# EAGLE design driver (EAGLE 7.5.0)
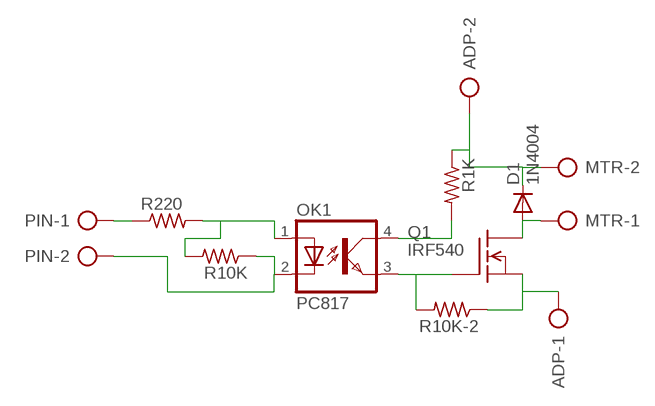
[diagram p0: schematic, sheet 1]

## Parts
ADP  AK300/2  [AK300/2]
D1  1N4004  [DO41-10]
MTR  AK300/2  [AK300/2]
OK1  PC817  [DIL04]
PIN  AK300/2  [AK300/2]
Q1  IRF540  [TO220]
R1K  R-US_0204/7  [0204/7]
R10K  R-US_0204/7  [0204/7]
R10K-2  R-US_0204/7  [0204/7]
R220  R-US_0204/7  [0204/7]

## Nets
N$1: OK1.1(A) R10K.2 R220.2
N$2: ADP.1 Q1.3(S) R10K-2.1
N$3: D1.A MTR.1 Q1.2(D)
N$4: OK1.3(EMIT) Q1.1(G) R10K-2.2
N$5: OK1.4(COL) R1K.2
N$7: PIN.1 R220.1
N$8: ADP.2 D1.C MTR.2 R1K.1
N$10: OK1.2(C) PIN.2 R10K.1

## Library data of the parts
ADP MTR PIN = con-ptr500:AK300/2: CONNECTOR; OC_FARNELL: unknown; OC_NEWARK: unknown
D1 = adafruit:1N4004: DIODE General purpose 1N400x type rectifier (With bigger pads) http://www.ladyada.net/library/pcb/eaglelibrary.html
OK1 = optocoupler:PC817: SHARP OPTO COUPLER; MPN: PC817X4J000F; OC_FARNELL: 9707727; OC_NEWARK: 97K7059
Q1 = transistor-fet:IRF540: N-Channel Enhancement MOSFET (HEXFET); 100V; 28A; 0,077Ohm
R1K R10K R10K-2 R220 = resistor:R-US_: RESISTOR, American symbol

## Board
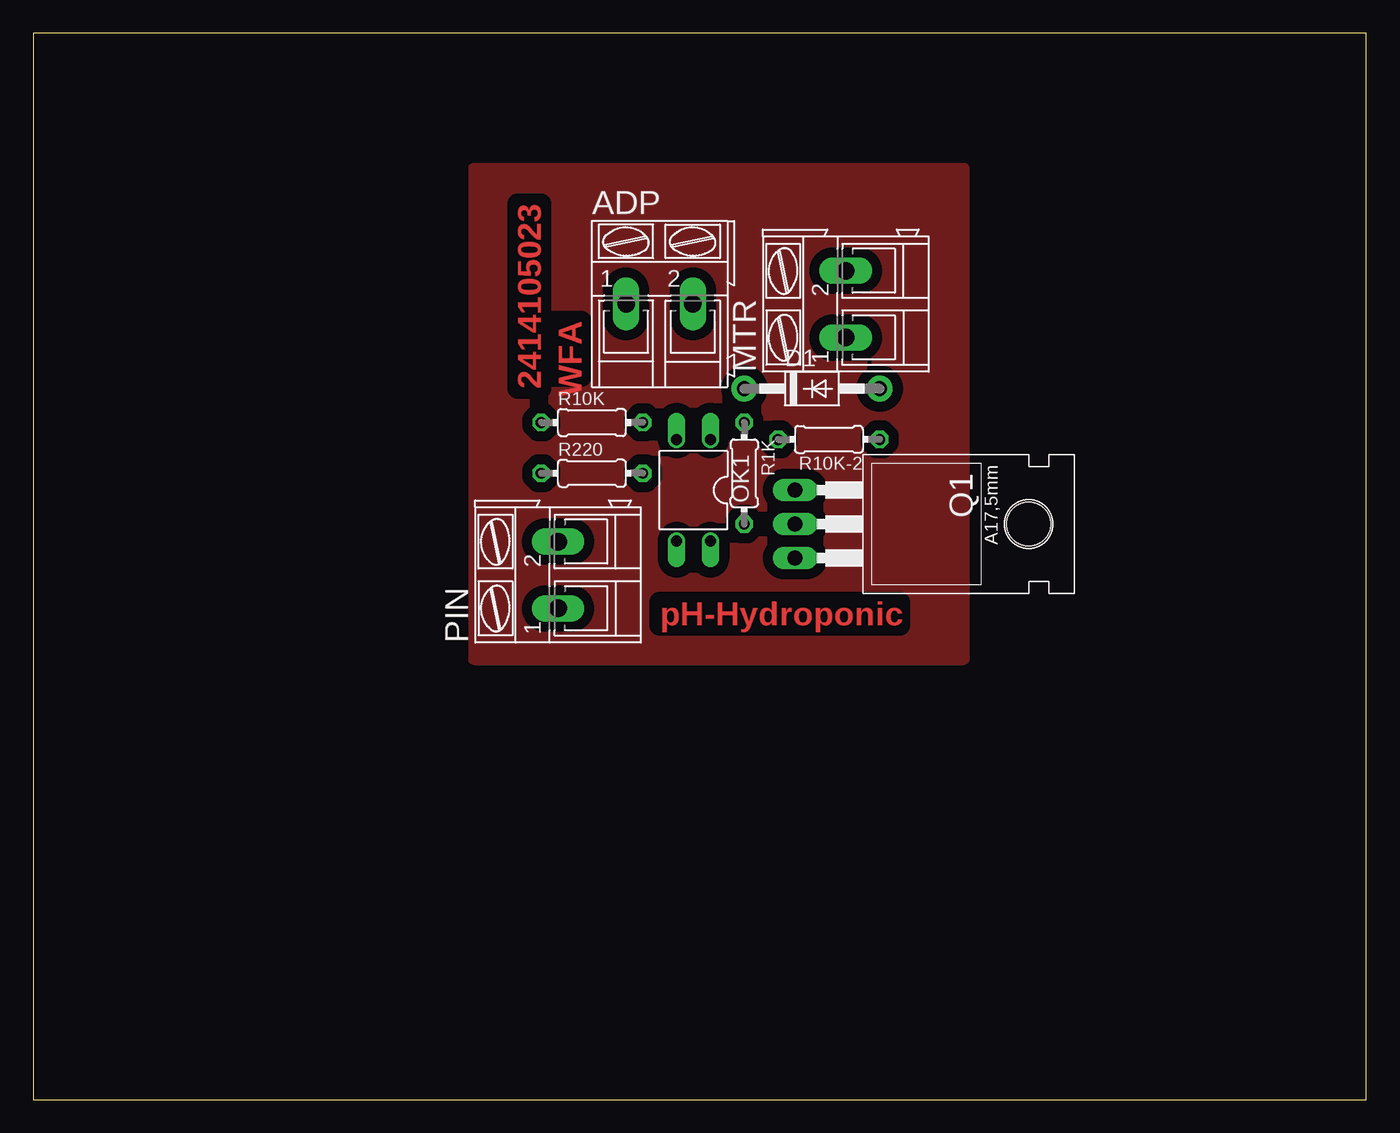
[diagram p1: board, top side]
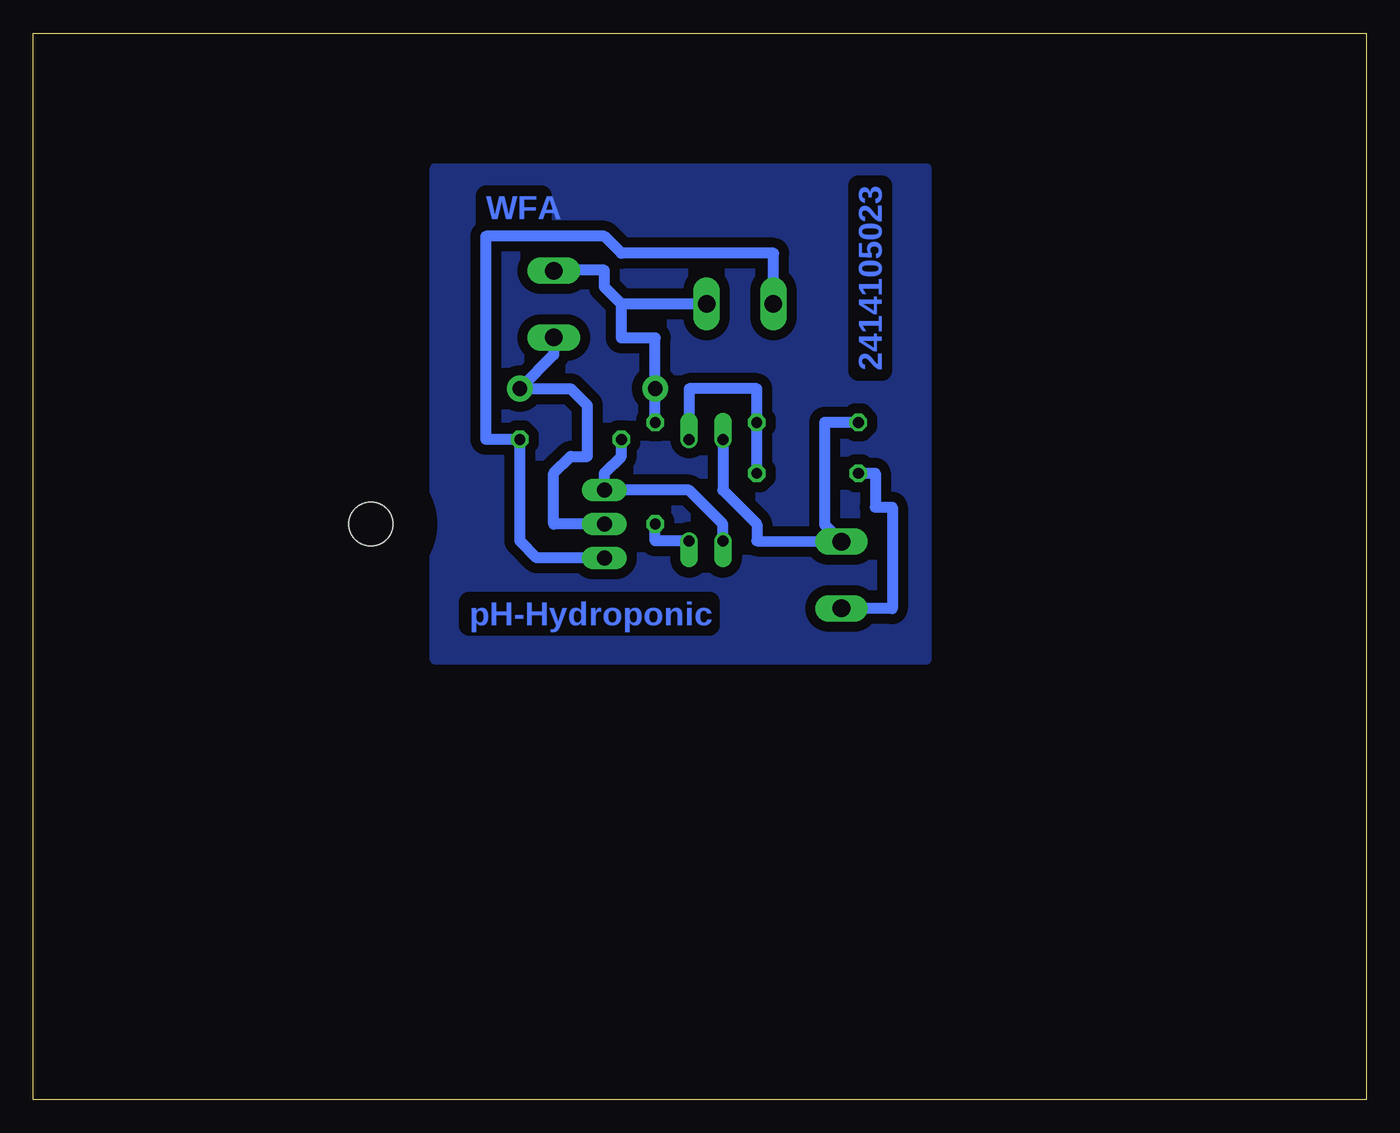
[diagram p2: board, bottom side, seen from below]

Size 100 x 80 mm. Coordinates in mm from the lower left corner, seen from the top.
Outline: 0,0 100,0 100,80 0,80 0,0
Copper layers (1*16): Top 0.035mm / dielectric 1.5mm / Bottom 0.035mm
Design rules "default": minimum track width 10mil, minimum drill 24mil, track to track 8mil, track to pad 8mil, pad to pad 8mil, via to via 8mil, smd to smd 8mil, copper to edge 40mil, drill to drill 8mil, minimum pad ring 10mil, minimum via ring 8mil, stop-mask expansion 4mil, vias tented up to drill 0mil, thermal gap 10mil

### Footprints (pad centres in the part's own frame; a part is rotated, then mirrored left to right if it is on the bottom)
AK300/2 = drill 1.321 long: 1 -2.515,0; 2 2.489,0
DO41-10 = drill 1.118 pad 1.93: A 5.08,0; C -5.08,0
DIL04 = drill 0.813 offset: 1 -1.27,-3.81; 2 1.27,-3.81; 3 1.27,3.81; 4 -1.27,3.81
TO220 = drill 1.118 long: 1 -2.54,-6.35; 2 0,-6.35; 3 2.54,-6.35 | hole 3.302: 0,11.176
0204/7 = drill 0.813 octagon: 1 -3.81,0; 2 3.81,0

### Placement (x,y rotation side)
ADP  46.99,59.69 0 top
D1  58.42,53.34 0 top
MTR  60.96,59.69 90 top
OK1  49.53,45.72 180 top
PIN  39.37,39.37 90 top
Q1  63.5,43.18 270 top
R1K  53.34,46.99 270 top
R10K  41.91,50.8 0 top
R10K-2  59.69,49.53 180 top
R220  41.91,46.99 0 top

### Tracks (layer width: path | path; a pad name or v marks a point on that pad's centre or on a via)
N$1
  Bottom 0.813: OK1.1 50.8,53.34 45.72,53.34 R10K.2 R220.2
N$2
  Bottom 0.813: 44.45,59.69 ADP.1 44.48,63.48 44.45,63.5 55.88,63.5 57.15,64.77 66.04,64.77 66.04,49.53 R10K-2.1 63.5,41.91 62.23,40.64 Q1.3
N$3
  Bottom 0.813: MTR.1 60.96,55.88 D1.A 59.69,53.34 58.42,52.07 58.42,48.26 59.69,48.26 60.96,46.99 60.96,43.18 Q1.2
N$4
  Bottom 0.813: OK1.3 48.26,43.18 50.8,45.72 Q1.1 57.15,46.99 55.88,48.26 R10K-2.2
N$5
  Bottom 0.813: OK1.4 53.34,41.91 R1K.2
N$6
  pour Bottom (isolate 0.762): 33.02,69.85 33.02,33.02 69.85,33.02 69.85,69.85
N$7
  Bottom 0.813: R220.1 36.83,46.99 36.83,44.45 35.56,44.45 35.56,36.83 39.34,36.83 PIN.1
N$8
  Bottom 0.813: ADP.2 55.88,59.69 | 55.88,59.69 57.15,60.96 57.15,62.23 60.91,62.23 MTR.2 | R1K.1 D1.C 53.34,57.15 55.88,57.15 55.88,59.69
N$9
  pour Top (isolate 0.762): 33.02,69.85 33.02,33.02 69.85,33.02 69.85,69.85
N$10
  Bottom 0.813: OK1.2 48.26,45.72 45.72,43.18 45.72,41.91 PIN.2 40.64,43.13 40.64,50.8 R10K.1

### Text on the board
Top: WFA | 2414105023 | pH-Hydroponic
Bottom: 2414105023 | WFA | pH-Hydroponic